# Altium schematic sheet NanoAvionics_ICD.SchDoc
size A4
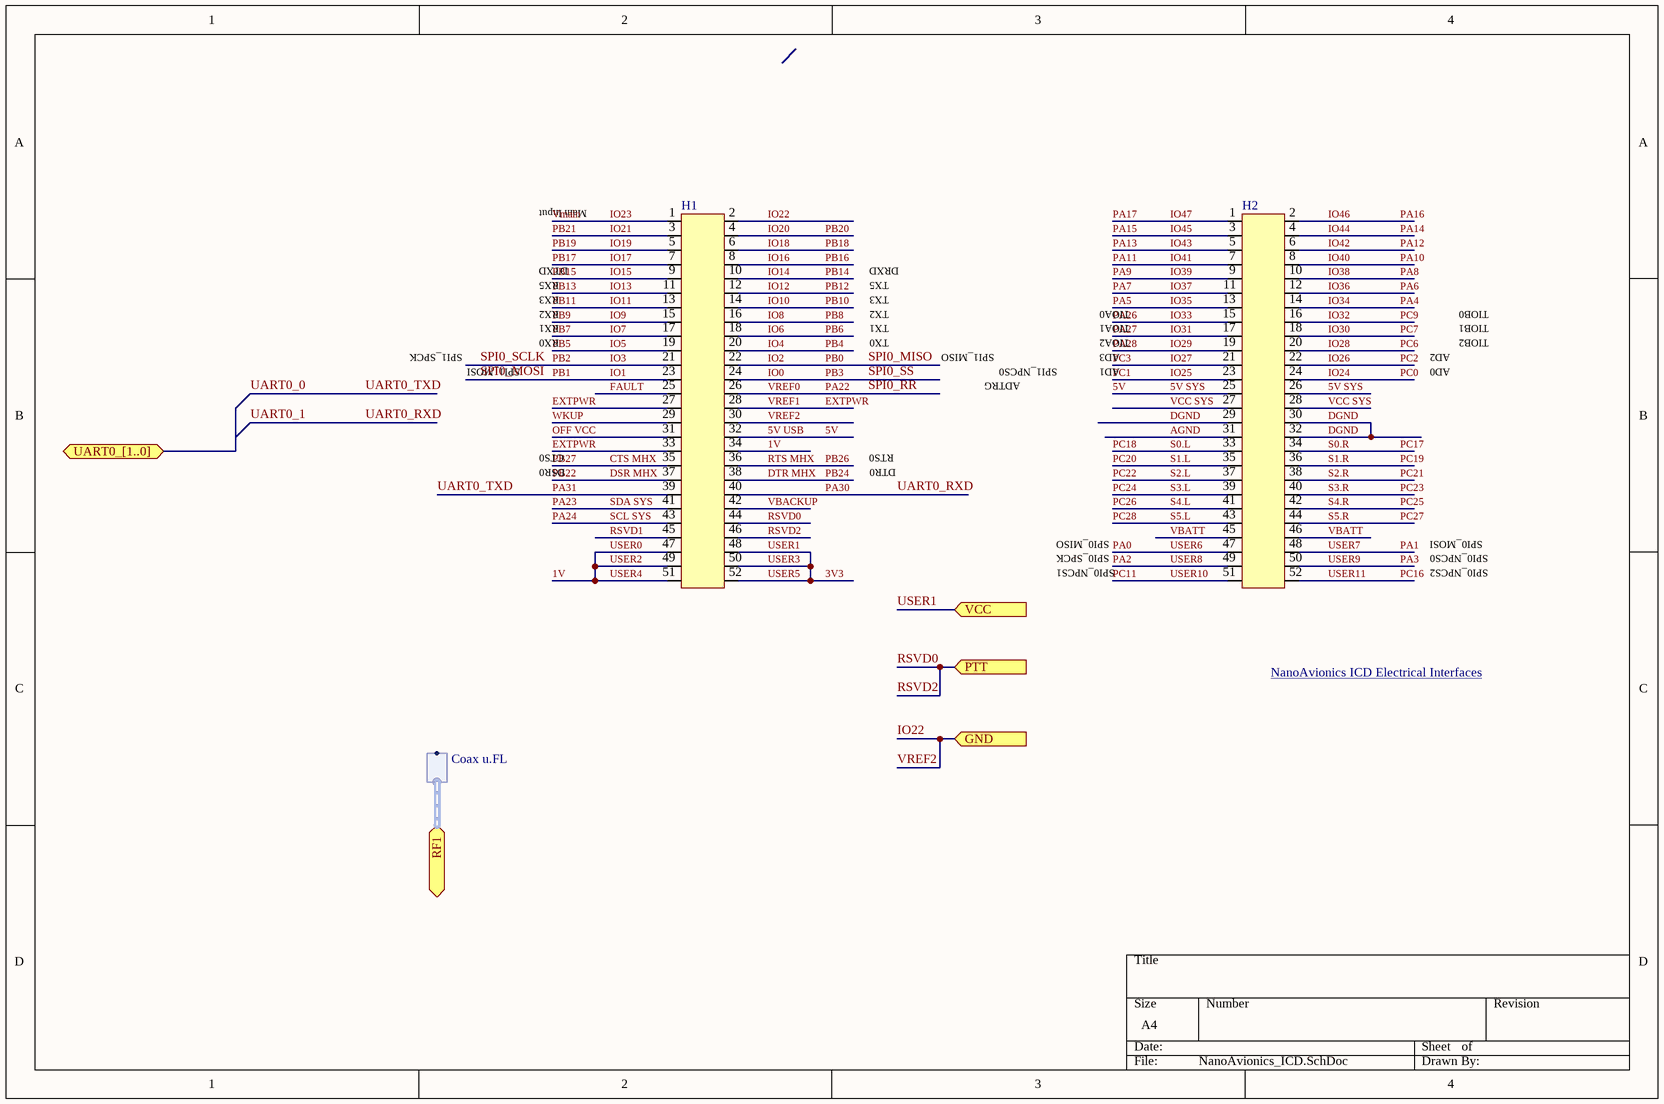
[diagram p0: NanoAvionics_ICD.SchDoc]

## Parts
H1  (no value)  [SAMTEC_ESQ_126_39_G_D]
H2  (no value)  [SAMTEC_ESQ_126_39_G_D]

## Ports
GND (in), PTT (in), RF1 (harness Coax u.FL), UART0_[1..0] (bidir), VCC (in)

## Harnesses
Coax u.FL: 

## Nets
1V: H1.34 H1.47 H1.49 H1.51  [also labelled USER0, USER2, USER4]
3V3: H1.48 H1.50 H1.52 ; port VCC  [also labelled USER1, USER3, USER5]
5V: H1.32 H2.25 H2.26  [also labelled 5V SYS, 5V USB]
AGND: H2.31
CTS MHX: H1.35  [also labelled PB27]
DGND: H2.29 H2.30 H2.32
DSR MHX: H1.37  [also labelled PB22]
DTR MHX: H1.38  [also labelled PB24]
EXTPWR: H1.27 H1.28 H1.33  [also labelled VREF1]
FAULT: H1.25
IO0: H1.24  [also labelled PB3, SPI0_SS]
IO1: H1.23  [also labelled PB1, SPI0_MOSI]
IO2: H1.22  [also labelled PB0, SPI0_MISO]
IO3: H1.21  [also labelled PB2, SPI0_SCLK]
IO4: H1.20  [also labelled PB4]
IO5: H1.19  [also labelled PB5]
IO6: H1.18  [also labelled PB6]
IO7: H1.17  [also labelled PB7]
IO8: H1.16  [also labelled PB8]
IO9: H1.15  [also labelled PB9]
IO10: H1.14  [also labelled PB10]
IO11: H1.13  [also labelled PB11]
IO12: H1.12  [also labelled PB12]
IO13: H1.11  [also labelled PB13]
IO14: H1.10  [also labelled PB14]
IO15: H1.9  [also labelled PB15]
IO16: H1.8  [also labelled PB16]
IO17: H1.7  [also labelled PB17]
IO18: H1.6  [also labelled PB18]
IO19: H1.5  [also labelled PB19]
IO20: H1.4  [also labelled PB20]
IO21: H1.3  [also labelled PB21]
IO22: H1.2 H1.30 ; port GND  [also labelled VREF2]
IO23: H1.1  [also labelled Vmain]
IO24: H2.24  [also labelled PC0]
IO25: H2.23  [also labelled PC1]
IO26: H2.22  [also labelled PC2]
IO27: H2.21  [also labelled PC3]
IO28: H2.20  [also labelled PC6]
IO29: H2.19  [also labelled PA28]
IO30: H2.18  [also labelled PC7]
IO31: H2.17  [also labelled PA27]
IO32: H2.16  [also labelled PC9]
IO33: H2.15  [also labelled PA26]
IO34: H2.14  [also labelled PA4]
IO35: H2.13  [also labelled PA5]
IO36: H2.12  [also labelled PA6]
IO37: H2.11  [also labelled PA7]
IO38: H2.10  [also labelled PA8]
IO39: H2.9  [also labelled PA9]
IO40: H2.8  [also labelled PA10]
IO41: H2.7  [also labelled PA11]
IO42: H2.6  [also labelled PA12]
IO43: H2.5  [also labelled PA13]
IO44: H2.4  [also labelled PA14]
IO45: H2.3  [also labelled PA15]
IO46: H2.2  [also labelled PA16]
IO47: H2.1  [also labelled PA17]
OFF VCC: H1.31
PA0: H2.47  [also labelled USER6]
PA1: H2.48  [also labelled USER7]
PA2: H2.49  [also labelled USER8]
PA3: H2.50  [also labelled USER9]
PA22: H1.26  [also labelled SPI0_RR, VREF0]
PA23: H1.41  [also labelled SDA SYS]
PA24: H1.43  [also labelled SCL SYS]
PA30: H1.40  [also labelled UART0_1, UART0_RXD]
PA31: H1.39  [also labelled UART0_0, UART0_TXD]
PB26: H1.36  [also labelled RTS MHX]
PC11: H2.51  [also labelled USER10]
PC16: H2.52  [also labelled USER11]
PC17: H2.34  [also labelled S0.R]
PC18: H2.33  [also labelled S0.L]
PC19: H2.36  [also labelled S1.R]
PC20: H2.35  [also labelled S1.L]
PC21: H2.38  [also labelled S2.R]
PC22: H2.37  [also labelled S2.L]
PC23: H2.40  [also labelled S3.R]
PC24: H2.39  [also labelled S3.L]
PC25: H2.42  [also labelled S4.R]
PC26: H2.41  [also labelled S4.L]
PC27: H2.44  [also labelled S5.R]
PC28: H2.43  [also labelled S5.L]
RSVD0: H1.44 H1.46 ; port PTT  [also labelled RSVD2]
RSVD1: H1.45
VBACKUP: H1.42
VBATT: H2.45 H2.46
VCC SYS: H2.27 H2.28
WKUP: H1.29

## Notes on the sheet
- Main Input
- RX1
- RX2
- RX3
- RX5
- DTXD
- TX1
- TX2
- TX3
- TX5
- DRXD
- TIOA0
- TIOA1
- TIOB0
- TIOB1
- SPI1_SPCK
- SPI1_MOSI
- RX0
- TX0
- SPI1_MISO
- ADTRG
- SPI1_NPCS0
- AD1
- AD3
- TIOA2
- AD0
- AD2
- TIOB2
- CTS0
- DSR0
- DTR0
- RTS0
- SPI0_MISO
- SPI0_MOSI
- SPI0_SPCK
- SPI0_NPCS1
- SPI0_NPCS0
- SPI0_NPCS2
- NanoAvionics ICD Electrical Interfaces <QB50_GAMANET_ICD_v2.0_20131128-1.pdf#nameddest=PC104Pins>

## Library data of the parts
H1 H2 = SAMTEC_ESQ_126_39_G_D: 26X2 header